# EAGLE design B171B (EAGLE 6.6.0)
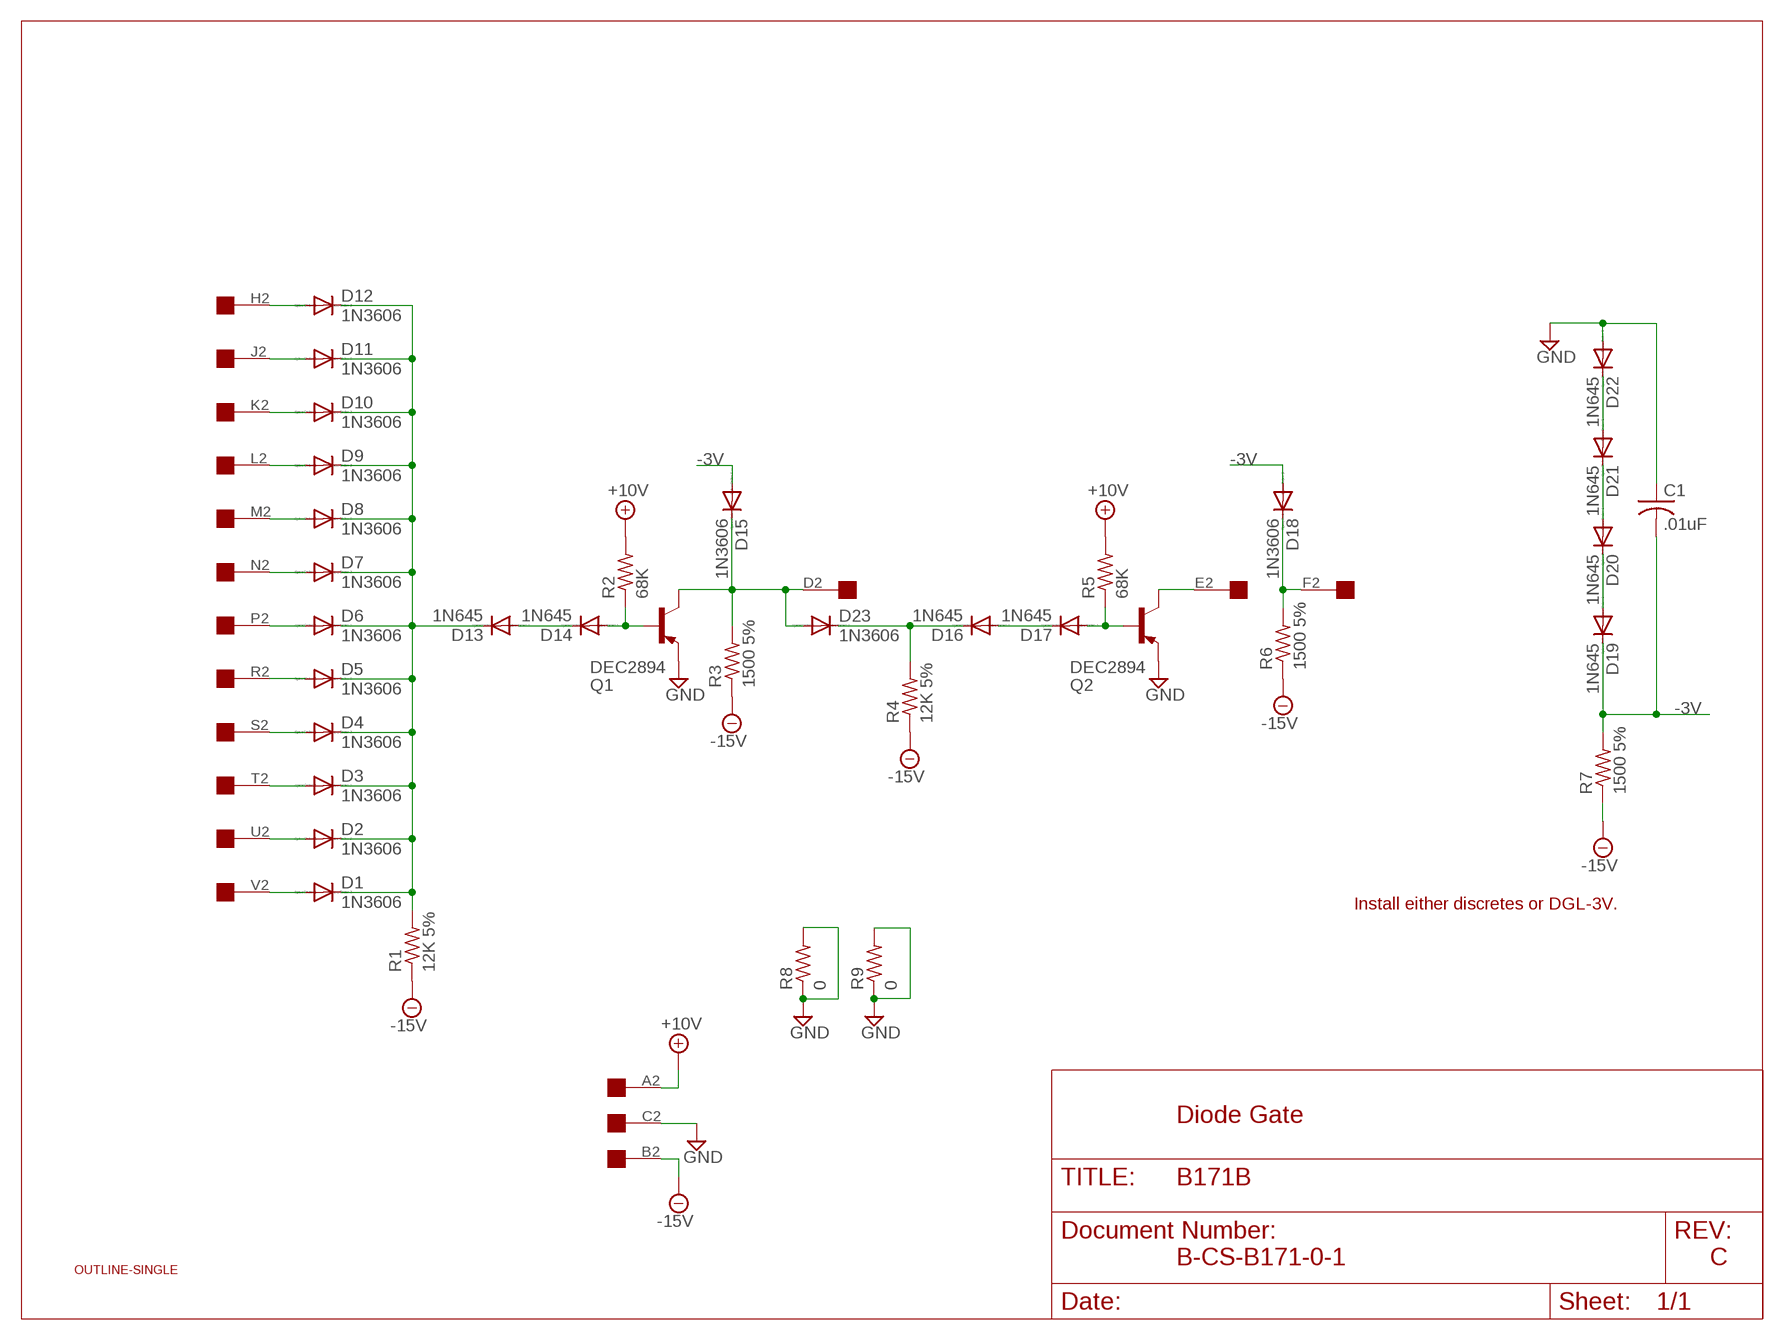
[diagram p0: schematic, sheet 1]

## Parts
C1  .01uF  C-US  [C063-025X075]
D1  1N3606  DIODE-DO35-10  [DO35-10]
D2  1N3606  DIODE-DO35-10  [DO35-10]
D3  1N3606  DIODE-DO35-10  [DO35-10]
D4  1N3606  DIODE-DO35-10  [DO35-10]
D5  1N3606  DIODE-DO35-10  [DO35-10]
D6  1N3606  DIODE-DO35-10  [DO35-10]
D7  1N3606  DIODE-DO35-10  [DO35-10]
D8  1N3606  DIODE-DO35-10  [DO35-10]
D9  1N3606  DIODE-DO35-10  [DO35-10]
D10  1N3606  DIODE-DO35-10  [DO35-10]
D11  1N3606  DIODE-DO35-10  [DO35-10]
D12  1N3606  DIODE-DO35-10  [DO35-10]
D13  1N645  DIODE-DO35-10  [DO35-10]
D14  1N645  DIODE-DO35-10  [DO35-10]
D15  1N3606  DIODE-DO35-10  [DO35-10]
D16  1N645  DIODE-DO35-10  [DO35-10]
D17  1N645  DIODE-DO35-10  [DO35-10]
D18  1N3606  DIODE-DO35-10  [DO35-10]
D19  1N645  DIODE-DO35-10  [DO35-10]
D20  1N645  DIODE-DO35-10  [DO35-10]
D21  1N645  DIODE-DO35-10  [DO35-10]
D22  1N645  DIODE-DO35-10  [DO35-10]
D23  1N3606  DIODE-DO35-10  [DO35-10]
Q1  DEC2894  -PNP-TO5  [TO5]
Q2  DEC2894  -PNP-TO5  [TO5]
R1  12K 5%  R-US_0207/10  [0207/10]
R2  68K  R-US_0207/10  [0207/10]
R3  1500 5%  R-US_0207/10  [0207/10]
R4  12K 5%  R-US_0207/10  [0207/10]
R5  68K  R-US_0207/10  [0207/10]
R6  1500 5%  R-US_0207/10  [0207/10]
R7  1500 5%  R-US_0207/10  [0207/10]
R8  0  R-US_0207/10  [0207/10]
R9  0  R-US_0207/10  [0207/10]
U$1  OUTLINE-SINGLE  [SINGLE]
U$2  EDGE-1  [EDGE-CON1]

## Nets
+10V: R2.2 R5.2 U$2.A2
-3V: C1.2 D15.A D18.A D19.C R7.2
-15V: R1.1 R3.1 R4.1 R6.1 R7.1 U$2.B2
D: D15.C D23.A Q1.3(C) R3.2 U$2.D2
E: Q2.3(C) U$2.E2
GND: C1.1 D22.A Q1.1(E) Q2.1(E) R8.1 R8.2 R9.1 R9.2 U$2.C2
H: D12.A U$2.H2
J: D11.A U$2.J2
K: D10.A U$2.K2
L: D9.A U$2.L2
M: D8.A U$2.M2
N: D7.A U$2.N2
N$1: D1.C D2.C D3.C D4.C D5.C D6.C D7.C D8.C D9.C D10.C D11.C D12.C D13.C R1.2
N$2: D13.A D14.C
N$3: D14.A Q1.2(B) R2.1
N$4: D16.C D23.C R4.2
N$5: D16.A D17.C
N$6: D17.A Q2.2(B) R5.1
N$7: D18.C R6.2 U$2.F2
N$10: D19.A D20.C
N$11: D20.A D21.C
N$12: D21.A D22.C
P: D6.A U$2.P2
R: D5.A U$2.R2
S: D4.A U$2.S2
T: D3.A U$2.T2
U: D2.A U$2.U2
V: D1.A U$2.V2

## Notes on the sheet
- Install either discretes or DGL-3V.
- Diode Gate
- B-CS-B171-0-1 | C

## Library data of the parts
C1 = dec-con:C-US: Capacitors with funky DEC lead spacing.
D1-D23 = diode:DIODE-: DIODE
Q1 Q2 = transistor:*-PNP-: PNP Transistror
R1-R9 = rcl:R-US_: RESISTOR, American symbol
U$1 = dec-con:OUTLINE-*: Board outlines for DEC boards.
U$2 = dec-con:EDGE-1: Single-Sided DEC Edge Connector -- (side 2)

## Net classes
0 default: width 0.813 mm

## Board
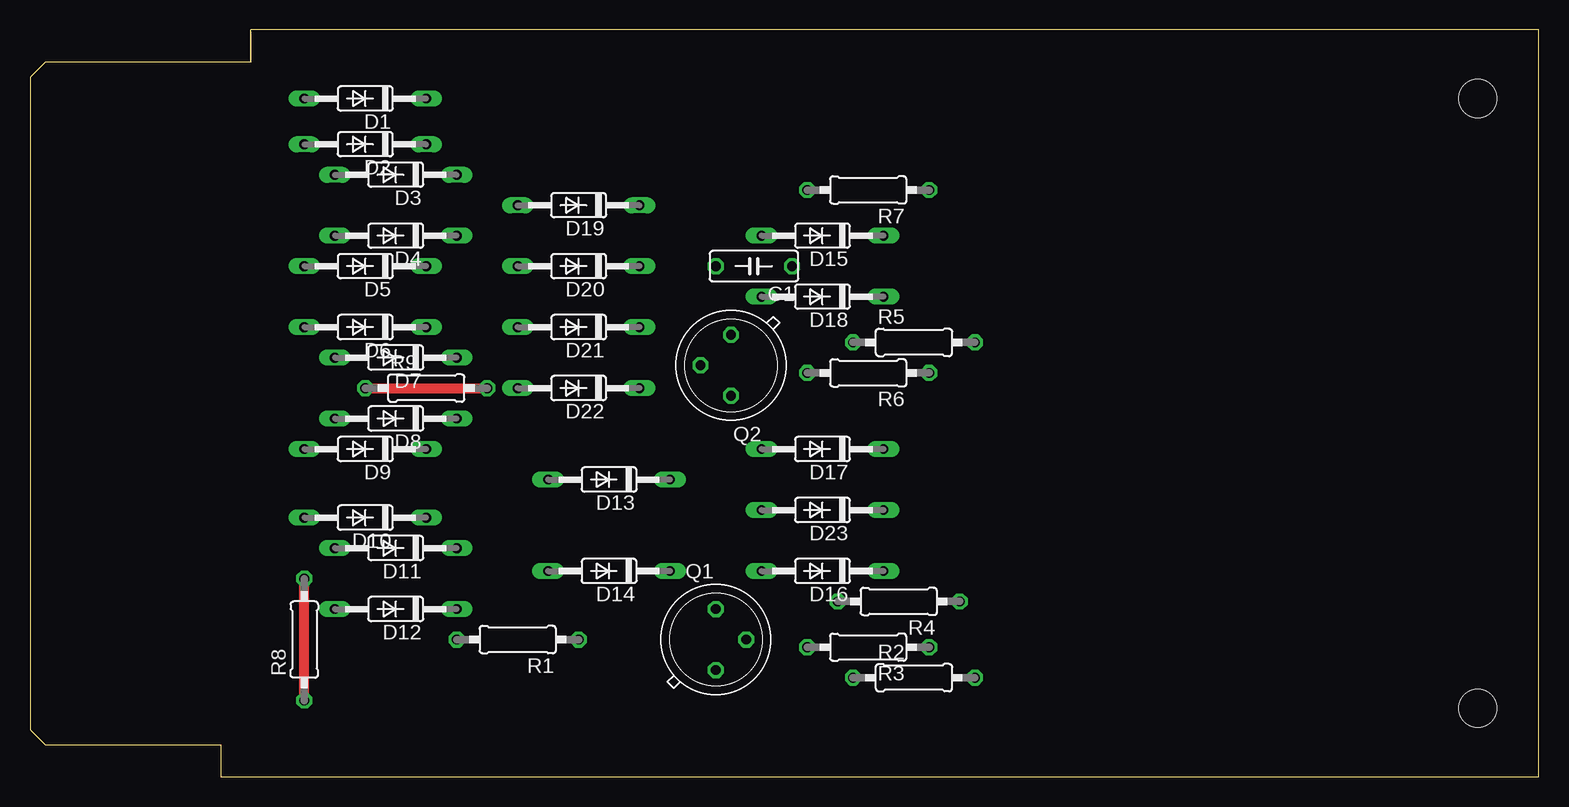
[diagram p1: board, top side]
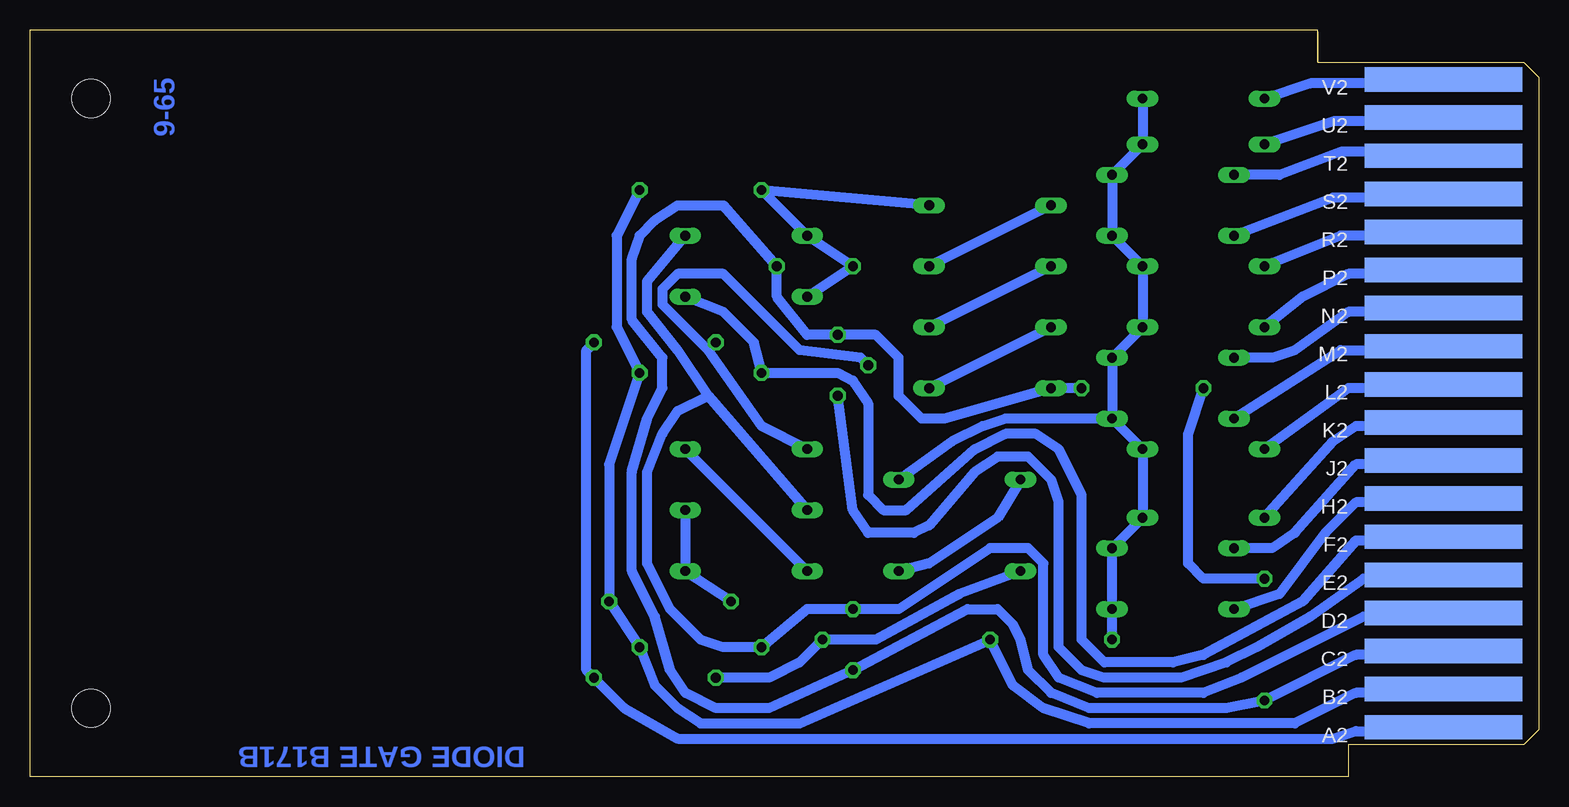
[diagram p2: board, bottom side, seen from below]

Size 125.73 x 62.23 mm. Coordinates in mm from the lower left corner, seen from the top.
Copper layers (1+16): Top 0.035mm / dielectric 1.5mm / Bottom 0.035mm
Design rules "16mils": minimum track width 16mil, minimum drill 32mil, track to track 15mil, track to pad 10mil, pad to pad 10mil, via to via 10mil, smd to smd 10mil, copper to edge 13mil, drill to drill 10mil, minimum pad ring 10mil, minimum via ring 8mil, stop-mask expansion 0mil, vias tented up to drill 0mil, thermal gap 10mil

### Footprints (pad centres in the part's own frame; a part is rotated, then mirrored left to right if it is on the bottom)
C063-025X075 = drill 0.813 octagon: 1 -2.54,0; 2 3.81,0
DO35-10 = drill 0.813 long: A 5.08,0; C -5.08,0
TO5 = drill 0.813 octagon: 1 0,-2.54; 2 2.54,0; 3 0,2.54
0207/10 = drill 0.813 octagon: 1 -5.08,0; 2 5.08,0
SINGLE = hole 3.175: 120.65,56.515; 120.65,5.715
EDGE-CON1 = smd 13.106 x 2.032 bottom: A2 7.938,4.128; B2 7.938,7.303; C2 7.938,10.477; D2 7.938,13.652; E2 7.938,16.828; F2 7.938,20.003; H2 7.938,23.177; J2 7.938,26.352; K2 7.938,29.527; L2 7.938,32.703; M2 7.938,35.877; N2 7.938,39.053; P2 7.938,42.227; R2 7.938,45.403; S2 7.938,48.578; T2 7.938,51.752; U2 7.938,54.928; V2 7.938,58.102

### Placement (x,y rotation side)
C1  60.96,42.55 180 top
D1  27.94,56.52 180 top
D2  27.94,52.7 180 top
D3  30.48,50.16 180 top
D4  30.48,45.09 180 top
D5  27.94,42.55 180 top
D6  27.94,37.47 180 top
D7  30.48,34.92 180 top
D8  30.48,29.84 180 top
D9  27.94,27.3 180 top
D10  27.94,21.59 180 top
D11  30.48,19.05 180 top
D12  30.48,13.97 180 top
D13  48.26,24.77 180 top
D14  48.26,17.14 180 top
D15  66.04,45.09 180 top
D16  66.04,17.14 180 top
D17  66.04,27.3 180 top
D18  66.04,40.01 180 top
D19  45.72,47.62 180 top
D20  45.72,42.55 180 top
D21  45.72,37.47 180 top
D22  45.72,32.38 180 top
D23  66.04,22.23 180 top
Q1  57.15,11.43 0 top
Q2  58.42,34.29 180 top
R1  40.64,11.43 180 top
R2  73.66,8.26 0 top
R3  69.85,10.79 180 top
R4  72.39,14.61 180 top
R5  73.66,36.2 0 top
R6  69.85,33.66 180 top
R7  69.85,48.9 180 top
R8  22.86,11.43 90 top
R9  33.02,32.38 0 top
U$1  0,0 0 top
U$2  0,0 0 top

### Tracks (layer width: path | path; a pad name or v marks a point on that pad's centre or on a via)
+10V
  Bottom 0.813: U$2.A2 8.89,3.81 15.24,3.81 17.15,3.17 71.76,3.17 76.2,5.71 R2.2 79.38,8.89 79.38,35.56 R5.2
-3V
  Bottom 0.813: D19.C R7.2 D15.A C1.2 D18.A
-15V
  Bottom 0.813: R7.1 76.84,45.09 76.84,37.47 R6.1 77.47,26.04 R4.1 R3.1 73.66,7.62 71.76,5.71 69.85,4.45 61.6,4.45 R1.1 43.82,7.62 41.28,5.71 37.47,4.45 20.32,4.45 15.24,6.99 8.26,6.99 U$2.B2
D
  Bottom 0.813: U$2.D2 8.89,13.34 14.61,13.34 24.77,8.26 27.94,6.99 36.83,6.99 40.01,8.26 41.28,10.16 41.28,17.78 42.55,19.05 45.72,19.05 53.34,13.97 Q1.3 60.96,13.97 R3.2 67.95,10.79 69.85,11.43 72.39,13.97 74.3,17.78 74.3,25.4 73.03,28.57 71.76,30.48 69.22,31.75 | 69.22,31.75 D23.A | 69.22,31.75 71.76,35.56 74.3,38.73 74.3,41.27 D15.C
E
  Bottom 0.813: U$2.E2 8.89,16.51 14.61,16.51 19.05,13.34 23.5,10.79 26.04,9.53 29.85,8.26 36.2,8.26 38.1,8.89 40.01,10.79 40.01,22.86 40.64,24.77 42.55,26.67 45.09,26.67 46.99,25.4 50.8,20.95 52.07,20.32 55.88,20.32 57.15,22.23 Q2.3
GND
  Top 0.813: R8.1 R8.2 | R9.1 R9.2
  Bottom 0.813: R9.2 D22.A 49.53,29.84 51.44,29.84 53.34,31.75 53.34,34.92 55.25,36.83 Q2.1 60.96,36.83 63.5,40.01 C1.1 67.95,47.62 71.76,47.62 73.66,46.35 74.93,45.09 75.57,43.18 75.57,38.1 73.03,34.92 73.03,32.38 74.3,29.84 75.57,25.4 75.57,17.14 73.66,13.34 72.39,8.89 71.12,6.99 68.58,5.71 64.14,5.71 Q1.1 47.63,13.97 45.09,13.97 43.82,12.7 43.18,11.43 42.55,8.89 40.64,6.99 37.47,5.71 26.04,5.71 R8.1 15.24,10.16 8.89,10.16 U$2.C2 | R8.2 27.94,16.51 29.21,17.78 29.21,28.57 R9.1
H
  Bottom 0.813: U$2.H2 8.89,22.86 15.24,22.86 17.78,20.32 21.59,15.24 D12.A
J
  Bottom 0.813: U$2.J2 8.89,26.04 15.24,26.04 20.32,20.32 22.23,19.05 D11.A
K
  Bottom 0.813: U$2.K2 8.26,29.21 15.24,29.21 17.15,27.94 D10.A
L
  Bottom 0.813: U$2.L2 8.89,32.38 15.88,32.38 D9.A
M
  Bottom 0.813: D8.A 16.51,35.56 8.89,35.56 U$2.M2
N
  Bottom 0.813: U$2.N2 8.89,38.73 15.88,38.73 20.32,35.56 22.23,34.92 D7.A
N$1
  Bottom 0.813: D8.C D9.C D10.C D11.C D12.C R1.2 | D8.C D7.C D6.C D5.C D4.C D3.C D2.C D1.C | D8.C 44.45,29.84 46.36,29.21 48.9,27.94 D13.C
N$2
  Bottom 0.813: D13.A 45.09,21.59 50.8,17.78 D14.C
N$3
  Bottom 0.813: R2.1 64.14,8.26 61.6,9.53 Q1.2 55.25,11.43 48.26,15.24 D14.A
N$4
  Bottom 0.813: D23.C D16.C R4.2
N$5
  Bottom 0.813: D16.A D17.C
N$6
  Bottom 0.813: Q2.2 56.52,34.92 61.6,35.56 67.95,41.91 71.76,41.91 73.03,40.64 73.03,39.37 69.22,35.56 | 69.22,35.56 R5.1 | D17.A 64.77,29.21 69.22,35.56
N$7
  Bottom 0.813: U$2.F2 9.53,19.68 15.24,19.68 19.69,14.61 27.94,10.16 30.48,9.53 36.2,9.53 38.1,11.43 38.1,23.5 40.01,27.3 41.91,28.57 44.45,28.57 46.99,27.3 52.71,22.23 54.61,22.23 55.88,23.5 55.88,31.11 57.15,33.02 58.42,33.66 R6.2 65.41,36.2 67.95,38.73 D18.C
N$10
  Bottom 0.813: D19.A D20.C
N$11
  Bottom 0.813: D20.A D21.C
N$12
  Bottom 0.813: D21.A D22.C
P
  Bottom 0.813: U$2.P2 8.89,41.91 15.88,41.91 19.69,40.01 D6.A
R
  Bottom 0.813: U$2.R2 8.89,45.09 16.51,45.09 D5.A
S
  Bottom 0.813: U$2.S2 8.89,48.26 17.15,48.26 D4.A
T
  Bottom 0.813: U$2.T2 10.16,52.07 16.51,52.07 21.59,50.16 D3.A
U
  Bottom 0.813: U$2.U2 8.89,54.61 17.15,54.61 D2.A
V
  Bottom 0.813: U$2.V2 9.53,57.78 19.05,57.78 D1.A

### Text on the board
Bottom: 9-65 | DIODE GATE B171B